# Altium schematic sheet P0_Main_Connect.SchDoc
size 299 x 199 mm
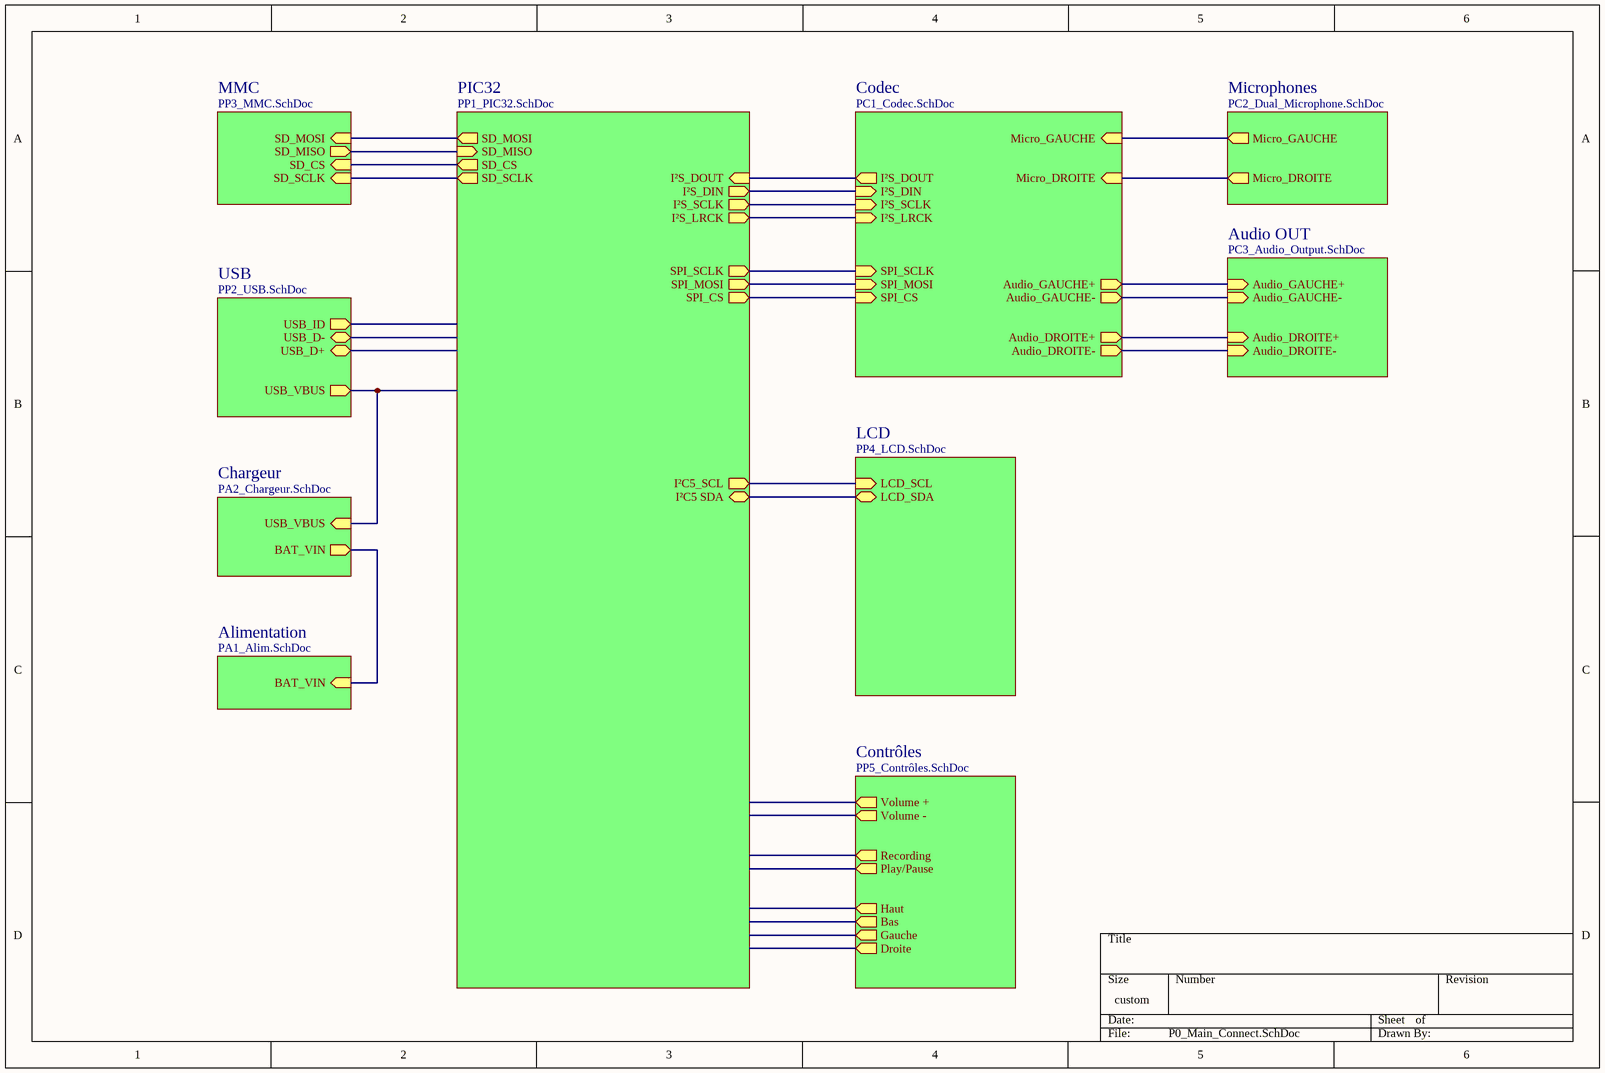
[diagram p0: P0_Main_Connect.SchDoc]

## Sub-sheets
Alimentation = PA1_Alim.SchDoc: BAT_VIN (in)
Audio OUT = PC3_Audio_Output.SchDoc: Audio_GAUCHE+ (in), Audio_GAUCHE- (in), Audio_DROITE+ (in), Audio_DROITE- (in)
Chargeur = PA2_Chargeur.SchDoc: USB_VBUS (in), BAT_VIN (out)
Codec = PC1_Codec.SchDoc: Micro_GAUCHE (in), Micro_DROITE (in), Audio_GAUCHE+ (out), Audio_GAUCHE- (out), Audio_DROITE+ (out), Audio_DROITE- (out), I²S_DIN (in), I²S_DOUT (out), SPI_MOSI (in), I²S_LRCK (in), I²S_SCLK (in), SPI_SCLK (in), SPI_CS (in)
Contrôles = PP5_Contrôles.SchDoc: Haut (out), Play/Pause (out), Bas (out), Recording (out), Volume + (out), Volume - (out), Gauche (out), Droite (out)
LCD = PP4_LCD.SchDoc: LCD_SCL (in), LCD_SDA (bidir)
Microphones = PC2_Dual_Microphone.SchDoc: Micro_GAUCHE (out), Micro_DROITE (out)
MMC = PP3_MMC.SchDoc: SD_MOSI (in), SD_MISO (out), SD_CS (in), SD_SCLK (in)
PIC32 = PP1_PIC32.SchDoc: I²C5_SCL (out), I²C5 SDA (bidir), I²S_LRCK (out), I²S_DIN (out), I²S_SCLK (out), I²S_DOUT (in), SPI_MOSI (out), SPI_CS (out), SPI_SCLK (out), SD_SCLK (out), SD_CS (out), SD_MOSI (out), SD_MISO (in)
USB = PP2_USB.SchDoc: USB_ID (out), USB_D- (bidir), USB_D+ (bidir), USB_VBUS (out)

## Nets
(unnamed): sheet Alimentation/BAT_VIN, sheet Chargeur/BAT_VIN
(unnamed): sheet Microphones/Micro_GAUCHE, sheet Codec/Micro_GAUCHE
(unnamed): sheet Microphones/Micro_DROITE, sheet Codec/Micro_DROITE
(unnamed): sheet Audio OUT/Audio_GAUCHE+, sheet Codec/Audio_GAUCHE+
(unnamed): sheet Audio OUT/Audio_GAUCHE-, sheet Codec/Audio_GAUCHE-
(unnamed): sheet Audio OUT/Audio_DROITE+, sheet Codec/Audio_DROITE+
(unnamed): sheet Audio OUT/Audio_DROITE-, sheet Codec/Audio_DROITE-
(unnamed): sheet Codec/I²S_DIN, sheet PIC32/I²S_DIN
(unnamed): sheet Codec/I²S_DOUT, sheet PIC32/I²S_DOUT
(unnamed): sheet Codec/SPI_MOSI, sheet PIC32/SPI_MOSI
(unnamed): sheet Codec/I²S_LRCK, sheet PIC32/I²S_LRCK
(unnamed): sheet Codec/I²S_SCLK, sheet PIC32/I²S_SCLK
(unnamed): sheet Codec/SPI_SCLK, sheet PIC32/SPI_SCLK
(unnamed): sheet Codec/SPI_CS, sheet PIC32/SPI_CS
(unnamed): sheet PIC32/I²C5_SCL, sheet LCD/LCD_SCL
(unnamed): sheet PIC32/I²C5 SDA, sheet LCD/LCD_SDA
(unnamed): sheet PIC32/SD_SCLK, sheet MMC/SD_SCLK
(unnamed): sheet PIC32/SD_CS, sheet MMC/SD_CS
(unnamed): sheet PIC32/SD_MOSI, sheet MMC/SD_MOSI
(unnamed): sheet PIC32/SD_MISO, sheet MMC/SD_MISO
(unnamed): sheet USB/USB_VBUS, sheet Chargeur/USB_VBUS